# Altium schematic sheet Kasli-SOC_power-controller.SchDoc: Kasli-SOC
size A3; SheetNumber: 16; SheetTotal: 18
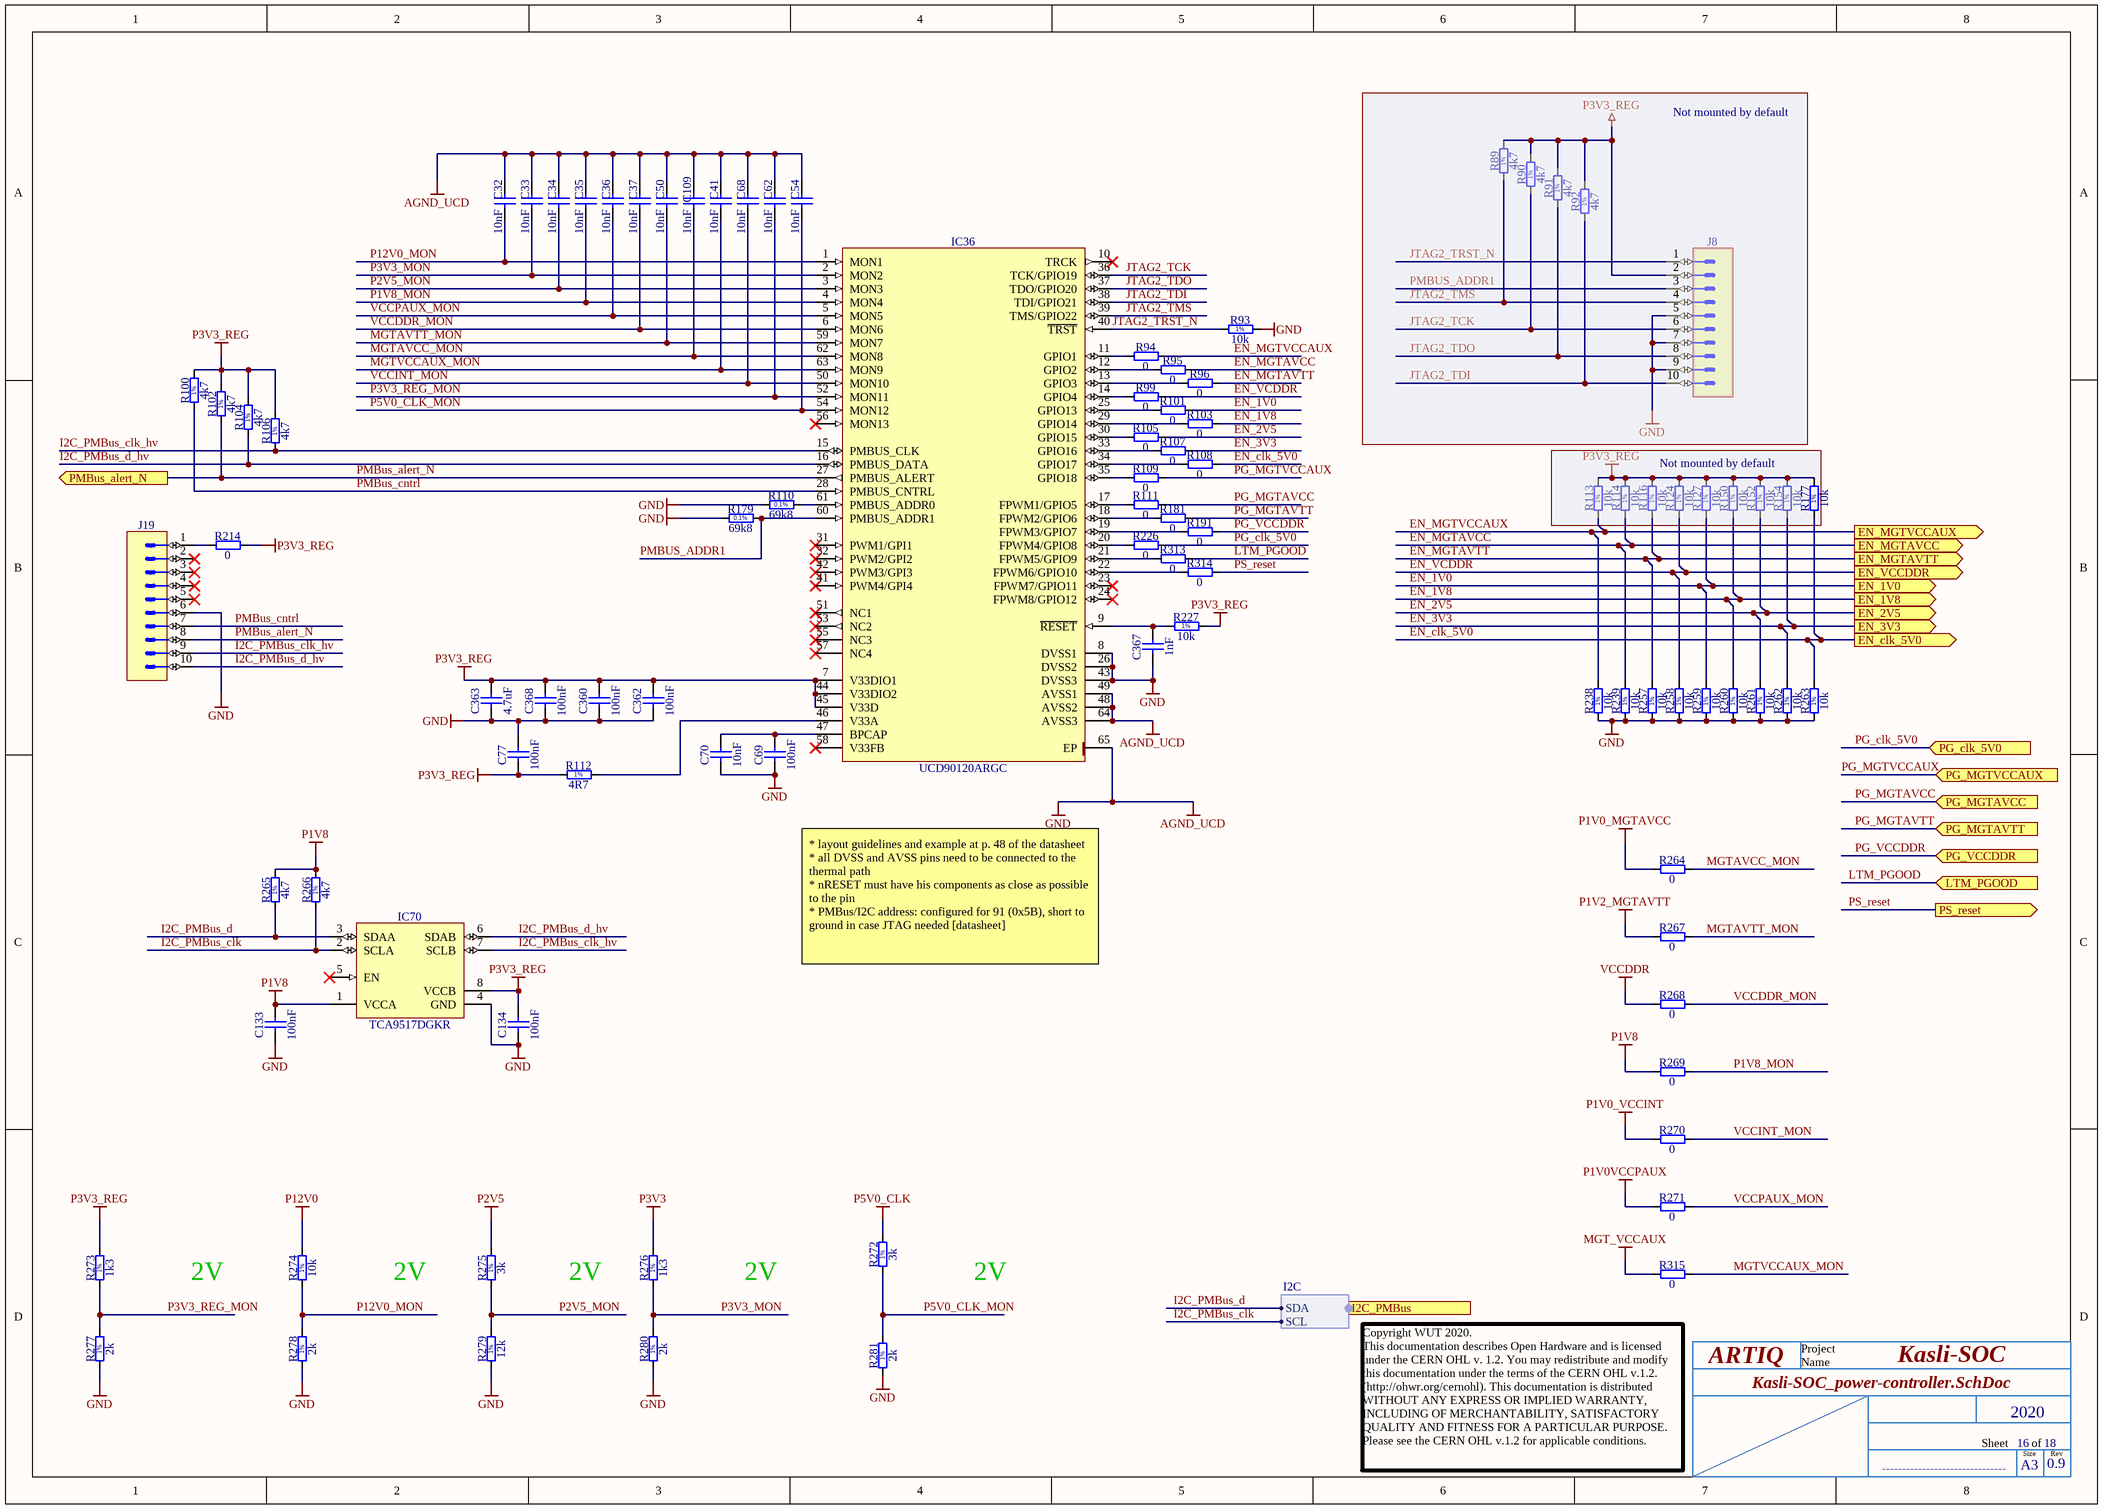
[diagram p0: Kasli-SOC_power-controller.SchDoc]

## Parts
C32  10nF  [CAPC1005X55N]
C33  10nF  [CAPC1005X55N]
C34  10nF  [CAPC1005X55N]
C35  10nF  [CAPC1005X55N]
C36  10nF  [CAPC1005X55N]
C37  10nF  [CAPC1005X55N]
C41  10nF  [CAPC1005X55N]
C50  10nF  [CAPC1005X55N]
C54  10nF  [CAPC1005X55N]
C62  10nF  [CAPC1005X55N]
C68  10nF  [CAPC1005X55N]
C69  100nF  [CAPC1005X55N]
C70  10nF  [CAPC1005X55N]
C77  100nF  [CAPC1005X55N]
C109  10nF  [CAPC1005X55N]
C133  100nF  [CAPC1005X55N]
C134  100nF  [CAPC1005X55N]
C360  100nF  [CAPC1005X55N]
C362  100nF  [CAPC1005X55N]
C363  4.7uF  [CAPC1005X55N]
C367  1nF  [CAPC1005X55N]
C368  100nF  [CAPC1005X55N]
IC36  UCD90120ARGC  [QFN50P900X900X100-65N-S425]
IC70  TCA9517DGKR  [SOP65P490X110-8N]
J8  AMPMODU  [TYCO_1241050-5]  (value not drawn)
J19  AMPMODU  [TYCO_1241050-5]  (value not drawn)
R89  4k7  [RESC1005X40N]
R90  4k7  [RESC1005X40N]
R91  4k7  [RESC1005X40N]
R92  4k7  [RESC1005X40N]
R93  10k  [RESC1005X40N]
R94  0  [RESC1005X40N]
R95  0  [RESC1005X40N]
R96  0  [RESC1005X40N]
R99  0  [RESC1005X40N]
R100  4k7  [RESC1005X40N]
R101  0  [RESC1005X40N]
R102  4k7  [RESC1005X40N]
R103  0  [RESC1005X40N]
R104  4k7  [RESC1005X40N]
R105  0  [RESC1005X40N]
R106  4k7  [RESC1005X40N]
R107  0  [RESC1005X40N]
R108  0  [RESC1005X40N]
R109  0  [RESC1005X40N]
R110  69k8  [RESC1608X55N]
R111  0  [RESC1005X40N]
R112  4R7  [RESC2012X60N]
R113  10k  [RESC1005X40N]
R114  10k  [RESC1005X40N]
R116  10k  [RESC1005X40N]
R124  10k  [RESC1005X40N]
R127  10k  [RESC1005X40N]
R150  10k  [RESC1005X40N]
R152  10k  [RESC1005X40N]
R154  10k  [RESC1005X40N]
R177  10k  [RESC1005X40N]
R179  69k8  [RESC1608X55N]
R181  0  [RESC1005X40N]
R191  0  [RESC1005X40N]
R214  0  [RESC1005X40N]
R226  0  [RESC1005X40N]
R227  10k  [RESC1005X40N]
R238  10k  [RESC1005X40N]
R239  10k  [RESC1005X40N]
R257  10k  [RESC1005X40N]
R258  10k  [RESC1005X40N]
R259  10k  [RESC1005X40N]
R260  10k  [RESC1005X40N]
R261  10k  [RESC1005X40N]
R262  10k  [RESC1005X40N]
R263  10k  [RESC1005X40N]
R264  0  [RESC1005X40N]
R265  4k7  [RESC2012X60N]
R266  4k7  [RESC2012X60N]
R267  0  [RESC1005X40N]
R268  0  [RESC1005X40N]
R269  0  [RESC1005X40N]
R270  0  [RESC1005X40N]
R271  0  [RESC1005X40N]
R272  3k  [RESC1005X40N]
R273  1k3  [RESC1005X40N]
R274  10k  [RESC1005X40N]
R275  3k  [RESC1005X40N]
R276  1k3  [RESC1005X40N]
R277  2k  [RESC1005X40N]
R278  2k  [RESC1005X40N]
R279  12k  [RESC1005X40N]
R280  2k  [RESC1005X40N]
R281  2k  [RESC1005X40N]
R313  0  [RESC1005X40N]
R314  0  [RESC1005X40N]
R315  0  [RESC1005X40N]

## Blocks framed on the sheet
Not mounted by default: J8 R89-R92
Not mounted by default: R113 R114 R116 R124 R127 R150 R152 R154 R177

## Ports
EN_1V0 (out), EN_1V8 (out), EN_2V5 (out), EN_3V3 (out), EN_clk_5V0 (out), EN_MGTAVCC (out), EN_MGTAVTT (out), EN_MGTVCCAUX (out), EN_VCCDDR (out), I2C_PMBus (harness I2C), LTM_PGOOD (in), PG_clk_5V0 (in), PG_MGTAVCC (in), PG_MGTAVTT (in), PG_MGTVCCAUX (in), PG_VCCDDR (in), PMBus_alert_N (out), PS_reset (out)

## Harnesses
I2C: SDA, SCL

## Nets
AGND_UCD: C32.2 C33.2 C34.2 C35.2 C36.2 C37.2 C41.2 C50.2 C54.2 C62.2 C68.2 C69.1 C70.1 C77.2 C109.2 C133.1 C134.1 C360.1 C362.1 C363.1 C367.1 C368.1 IC36.8(DVSS1) IC36.26(DVSS2) IC36.43(DVSS3) IC36.48(AVSS2) IC36.49(AVSS1) IC36.64(AVSS3) IC36.65(EP) IC70.4(GND) J8.5 J8.7 J8.9 J19.6 R93.2 R110.1 R179.1 R238.1 R239.1 R257.1 R258.1 R259.1 R260.1 R261.1 R262.1 R263.1 R277.1 R278.1 R279.1 R280.1 R281.1  [also labelled GND]
MGT_VCCAUX: R315.1
P1V0_MGTAVCC: R264.1
P1V0_VCCINT: R270.1
P1V0VCCPAUX: R271.1
P1V2_MGTAVTT: R267.1
P1V8: C133.2 IC70.1(VCCA) R265.2 R266.2 R269.1
P2V5: R275.2
P3V3: R276.2
P3V3_REG: C77.1 C134.2 C360.2 C362.2 C363.2 C368.2 IC36.7(V33DIO1) IC36.44(V33DIO2) IC36.45(V33D) IC70.8(VCCB) J8.2 R89.2 R90.2 R91.2 R92.2 R100.2 R102.2 R104.2 R106.2 R112.1 R113.2 R114.2 R116.2 R124.2 R127.2 R150.2 R152.2 R154.2 R177.2 R214.2 R227.2 R273.2
P5V0_CLK: R272.2
P12V0: R274.2
VCCDDR: R268.1
EN_1V0: R101.2 R127.1 R259.2 ; port EN_1V0
EN_1V8: R103.2 R150.1 R260.2 ; port EN_1V8
EN_2V5: R105.2 R152.1 R261.2 ; port EN_2V5
EN_3V3: R107.2 R154.1 R262.2 ; port EN_3V3
EN_clk_5V0: R108.2 R177.1 R263.2 ; port EN_clk_5V0
EN_MGTAVCC: R95.2 R114.1 R239.2 ; port EN_MGTAVCC
EN_MGTAVTT: R96.2 R116.1 R257.2 ; port EN_MGTAVTT
EN_MGTVCCAUX: R94.2 R113.1 R238.2 ; port EN_MGTVCCAUX
EN_VCDDR: R99.2 R124.1 R258.2 ; port EN_VCCDDR
I2C_PMBus_clk: IC70.2(SCLA) R266.1 ; port I2C_PMBus.SCL
I2C_PMBus_clk_hv: IC36.15(PMBUS_CLK) IC70.7(SCLB) J19.9 R106.1
I2C_PMBus_d: IC70.3(SDAA) R265.1 ; port I2C_PMBus.SDA
I2C_PMBus_d_hv: IC36.16(PMBUS_DATA) IC70.6(SDAB) J19.10 R104.1
JTAG2_TCK: IC36.36(TCK/GPIO19) J8.6 R90.1
JTAG2_TDI: IC36.38(TDI/GPIO21) J8.10 R92.1
JTAG2_TDO: IC36.37(TDO/GPIO20) J8.8 R91.1
JTAG2_TMS: IC36.39(TMS/GPIO22) J8.4 R89.1
JTAG2_TRST_N: IC36.40(~{TRST}) J8.1 R93.1
LTM_PGOOD: R313.2 ; port LTM_PGOOD
MGTAVCC_MON: C109.1 IC36.62(MON8) R264.2
MGTAVTT_MON: C50.1 IC36.59(MON7) R267.2
MGTVCCAUX_MON: C41.1 IC36.63(MON9) R315.2
P1V8_MON: C35.1 IC36.4(MON4) R269.2
P2V5_MON: C34.1 IC36.3(MON3) R275.1 R279.2
P3V3_MON: C33.1 IC36.2(MON2) R276.1 R280.2
P3V3_REG_MON: C62.1 IC36.52(MON11) R273.1 R277.2
P5V0_CLK_MON: C54.1 IC36.54(MON12) R272.1 R281.2
P12V0_MON: C32.1 IC36.1(MON1) R274.1 R278.2
PG_clk_5V0: R226.2 ; port PG_clk_5V0
PG_MGTAVCC: R111.2 ; port PG_MGTAVCC
PG_MGTAVTT: R181.2 ; port PG_MGTAVTT
PG_MGTVCCAUX: R109.2 ; port PG_MGTVCCAUX
PG_VCCDDR: R191.2 ; port PG_VCCDDR
PMBUS_ADDR1: IC36.60(PMBUS_ADDR1) J8.3 R179.2
PMBus_alert_N: IC36.27(PMBUS_ALERT) J19.8 R102.1 ; port PMBus_alert_N
PMBus_cntrl: IC36.28(PMBUS_CNTRL) J19.7 R100.1
PS_reset: R314.2 ; port PS_reset
VCCDDR_MON: C37.1 IC36.6(MON6) R268.2
VCCINT_MON: C68.1 IC36.50(MON10) R270.2
VCCPAUX_MON: C36.1 IC36.5(MON5) R271.2
NetC69_2: C69.2 C70.2 IC36.47(BPCAP)
NetC367_2: C367.2 IC36.9(~{RESET}) R227.1
NetIC36_11: IC36.11(GPIO1) R94.1
NetIC36_12: IC36.12(GPIO2) R95.1
NetIC36_13: IC36.13(GPIO3) R96.1
NetIC36_14: IC36.14(GPIO4) R99.1
NetIC36_17: IC36.17(FPWM1/GPIO5) R111.1
NetIC36_18: IC36.18(FPWM2/GPIO6) R181.1
NetIC36_19: IC36.19(FPWM3/GPIO7) R191.1
NetIC36_20: IC36.20(FPWM4/GPIO8) R226.1
NetIC36_21: IC36.21(FPWM5/GPIO9) R313.1
NetIC36_22: IC36.22(FPWM6/GPIO10) R314.1
NetIC36_25: IC36.25(GPIO13) R101.1
NetIC36_29: IC36.29(GPIO14) R103.1
NetIC36_30: IC36.30(GPIO15) R105.1
NetIC36_33: IC36.33(GPIO16) R107.1
NetIC36_34: IC36.34(GPIO17) R108.1
NetIC36_35: IC36.35(GPIO18) R109.1
NetIC36_46: IC36.46(V33A) R112.2
NetIC36_61: IC36.61(PMBUS_ADDR0) R110.2
NetJ19_1: J19.1 R214.1

Not connected (* = marked no-connect by the designer): IC36 10(TRCK)* 23(FPWM7/GPIO11)* 24(FPWM8/GPIO12)* 31(PWM1/GPI1)* 32(PWM2/GPI2)* 41(PWM4/GPI4)* 42(PWM3/GPI3)* 51(NC1)* 53(NC2)* 55(NC3)* 56(MON13)* 57(NC4)* 58(V33FB)*; IC70 5(EN)*; J19 2* 3* 4* 5*

## Notes on the sheet
- * layout guidelines and example at p. 48 of the datasheet
  * all DVSS and AVSS pins need to be connected to the thermal path
  * nRESET must have his components as close as possible to the pin
  * PMBus/I2C address: configured for 91 (0x5B), short to ground in case JTAG needed [datasheet]
- 2V
- (near R315) Copyright WUT 2020.
  This documentation describes Open Hardware and is licensed under the CERN OHL v. 1.2. You may redistribute and modify this documentation under the terms of the CERN OHL v.1.2. (http://ohwr.org/cernohl). This documentation is distributed WITHOUT ANY EXPRESS OR IMPLIED WARRANTY, INCLUDING OF MERCHANTABILITY, SATISFACTORY QUALITY AND FITNESS FOR A PARTICULAR PURPOSE.
  Please see the CERN OHL v.1.2 for applicable conditions.
- ARTIQ
- Project
- Name
- Sheet
- 2020
- Size
- A3
- of
- Rev
- -------------------------------
- 0.9
- (in symbol R0402_1K3_1%_0.0625W_100PPM) 1%
- (in symbol R0402_2K_1%_0.0625W_100PPM) 1%
- (in symbol R0402_3K_1%_0.0625W_100PPM) 1%
- (in symbol R0402_4K7_1%_0.0625W_100PPM) 1%
- (in symbol R0402_10K_1%_0.0625W_100PPM) 1%
- (in symbol R0402_12K_1%_0.0625W_100PPM) 1%
- (in symbol R0603_69K8_0.1%_0.063W_10PPM) 0.1%
- (in symbol R0805_4K7_1%_0.125W_100PPM) 1%
- (in symbol R0805_4R7_1%_0.125W_200PPM) 1%

## Library data of the parts
C32-C37 C41 C50 C54 C62 C68 C70 C109 = CC0402_10NF_25V_10%_X7R: Non-polarised capacitor; Part Description: SMD Multilayer Chip Ceramic Capacitor; Manufacturer: GENERIC; Manufacturer1 Part Number: C1005X7R1E103KT; Voltage: 25V; TC: X7R; Tolerance: ±10%; Part Number: CC0402_10NF_25V_10%_X7R; Component Kind: Standard; Component Type: Standard; Pin Count: 2; Value: 10nF; Status: Preferred; Manufacturer Part Number: CC0402_10NF_25V_10%_X7R; Case: 0402; Mounted: Yes; Socket: No; SMD: Yes; Sense: No; Manufacturer1 Example: TDK; Manufacturer1 ComponentHeight: 0.55mm; HelpURL: \\cern.ch\dfs\Applications\Altium\Datasheets\CC0402_X7R_TDK_C.pdf; Author: CERN DEM JLC; CreateDate: 10/25/2012; LatestRevisionDate: 10/25/2012
C69 C77 C133 C134 C360 C362 C368 = CC0402_100NF_16V_10%_X7R: Non-polarised capacitor; Part Description: SMD Multilayer Chip Ceramic Capacitor; Manufacturer: GENERIC; Manufacturer1 Part Number: GRM155R71C104KA88D; Voltage: 16V; TC: X7R; Tolerance: ±10%; Part Number: CC0402_100NF_16V_10%_X7R; Component Kind: Standard; Component Type: Standard; Pin Count: 2; Value: 100nF; Status: Not Recommended; Manufacturer Part Number: CC0402_100NF_16V_10%_X7R; Case: 0402; Mounted: Yes; Socket: No; SMD: Yes; Sense: No; Manufacturer1 Example: MURATA; Manufacturer1 ComponentHeight: 0.55mm; HelpURL: \\cern.ch\dfs\Applications\Altium\Datasheets\CC0402_X7R_MURATA_GRM.pdf; Author: CERN DEM JLC; CreateDate: 05/12/2013; LatestRevisionDate: 03/12/2007
C363 = CC0402_4.7UF_6.3V_20%_X5R: Non-polarised capacitor; Part Description: SMD Multilayer Chip Ceramic Capacitor; Manufacturer: GENERIC; Manufacturer1 Part Number: C1005X5R0J475M050BC; Voltage: 6.3V; TC: X5R; Tolerance: ±20%; Part Number: CC0402_4.7UF_6.3V_20%_X5R; Component Kind: Standard; Component Type: Standard; Pin Count: 2; Value: 4.7uF; Status: Preferred; Manufacturer Part Number: CC0402_4.7UF_6.3V_20%_X5R; Case: 0402; Mounted: Yes; Socket: No; SMD: Yes; Sense: No; Manufacturer1 Example: TDK; Manufacturer1 ComponentHeight: 0.65mm; HelpURL: \\cern.ch\dfs\Applications\Altium\Datasheets\CC0402_X5R_TDK_C.pdf; Author: CERN DEM JLC; CreateDate: 03/03/2015; LatestRevisionDate: 03/03/2015
C367 = CC0402_1NF_50V_10%_X7R: Non-polarised capacitor; Part Description: SMD Multilayer Chip Ceramic Capacitor; Manufacturer: GENERIC; Manufacturer1 Part Number: 223858715623; Voltage: 50V; TC: X7R; Tolerance: ±10%; Part Number: CC0402_1NF_50V_10%_X7R; Component Kind: Standard; Component Type: Standard; Pin Count: 2; Value: 1nF; Status: Not Recommended; Manufacturer Part Number: CC0402_1NF_50V_10%_X7R; Case: 0402; Mounted: Yes; Socket: No; SMD: Yes; Sense: No; Manufacturer1 Example: PHYCOMP; Manufacturer1 ComponentHeight: 0.55mm; HelpURL: \\cern.ch\dfs\Applications\Altium\Datasheets\CC0402_X7R_PHYCOMP.pdf; Author: CERN DEM JLC; CreateDate: 03/12/2007; LatestRevisionDate: 03/12/2007
IC36 = UCD90120ARGC: 12-Rail Power Supply Sequencer and Monitor; Part Description: 12-Rail Power Supply Sequencer and Monitor With ACPI Support; Manufacturer: TEXAS INSTRUMENTS; PressFit: No; Bonding: No; Part Number: UCD90120ARGC; Component Kind: Standard; Component Type: Standard; Device: UCD90120ARGC; PackageDescription: QFN, 0.50mm Pitch, Square; 64 Pin, 9.00mm L X 9.00mm W X 1.00mm H Body (4.25 X 4.25mm Thermal Tab), IPC Medium Density; Manufacturer Part Number: UCD90120ARGC; Pin Count: 65; Case: QFN64; Mounted: Yes; Socket: No; SMD: Yes; Sense: No; ComponentHeight: 1mm; Author: CERN DEM MR; HelpURL: \\cern.ch\dfs\Applications\Altium\Datasheets\UCD90120ARGC.pdf; CreateDate: 14/12/2015; LatestRevisionDate: 26/01/2016
IC70 = TCA9517DGKR: Level-Translating I2C Bus Repeater; Manufacturer: TEXAS INSTRUMENTS; PressFit: No; Bonding: No; Part Number: TCA9517DGKR; Component Kind: Standard; Component Type: Standard; Device: TCA9517DGKR; PackageDescription: SOP, 0.65mm pitch; 8 pin, 3.00mm W X 3.00mm L X 1.10mm H body, IPC Medium Density; Part Description: Level-Translating I2C Bus Repeater; Manufacturer Part Number: TCA9517DGKR; Pin Count: 8; Case: TSSOP8; Mounted: Yes; Socket: No; SMD: Yes; Sense: No; ComponentHeight: 1.1mm; Author: CERN DEM JLC; HelpURL: \\cern.ch\dfs\Applications\Altium\Datasheets\TCA9517DGKR.pdf; CreateDate: 07/07/2014; LatestRevisionDate: 07/07/2014
J8 J19 = TYCO_1241050-5: Connector 10 Male; Part Description: 10 Positions, Pitch 2.54mm, Dual-Row Surface Mount Vertical Header; Manufacturer: TYCO ELECTRONICS; PressFit: No; Part Number: TYCO_1241050-5; Component Kind: Standard; Component Type: Standard; Pin Count: 10; Family: AMPMODU; Mounted: Yes; Socket: No; SMD: Yes; Sense: No; Status: None; Manufacturer Part Number: TYCO_1241050-5; ComponentHeight: 10.21mm; HelpURL: \\cern.ch\dfs\Applications\Altium\Datasheets\TYCO_1241050-5.pdf; Author: CERN DEM JMW; CreateDate: 12/08/2015; LatestRevisionDate: 12/08/2015
R89-R92 R100 R102 R104 R106 = R0402_4K7_1%_0.0625W_100PPM: Resistor - 1%; Part Description: General Purpose Thick Film Chip Resistor; Manufacturer: GENERIC; Manufacturer1 Part Number: 232270674702L; TC: ±100ppm/°C; Part Number: R0402_4K7_1%_0.0625W_100PPM; Component Kind: Standard; Component Type: Standard; Pin Count: 2; Value: 4k7; Status: Not recommended; Power: 0.0625W; Tolerance: ±1%; Manufacturer Part Number: R0402_4K7_1%_0.0625W_100PPM; Case: 0402; Mounted: Yes; Sense: No; Socket: No; SMD: Yes; Manufacturer1 Example: YAGEO PHYCOMP; Manufacturer1 ComponentHeight: 0.4mm; HelpURL: \\cern.ch\dfs\Applications\Altium\Datasheets\R0402_Phycomp_RC0402.pdf; Author: CERN DEM JLC; CreateDate: 03.12.2007; LatestRevisionDate: 17.10.2012
R93 R113 R114 R116 R124 R127 R150 R152 R154 R177 R227 R238 R239 R257-R263 R274 = R0402_10K_1%_0.0625W_100PPM: Resistor - 1%; Part Description: General Purpose Thick Film Chip Resistor; Manufacturer: GENERIC; Manufacturer1 Part Number: 232270671003L; TC: ±100ppm/°C; Part Number: R0402_10K_1%_0.0625W_100PPM; Component Kind: Standard; Component Type: Standard; Pin Count: 2; Value: 10k; Status: Not recommended; Power: 0.0625W; Tolerance: ±1%; Manufacturer Part Number: R0402_10K_1%_0.0625W_100PPM; Case: 0402; Mounted: Yes; Sense: No; Socket: No; SMD: Yes; Manufacturer1 Example: YAGEO PHYCOMP; Manufacturer1 ComponentHeight: 0.4mm; HelpURL: \\cern.ch\dfs\Applications\Altium\Datasheets\R0402_Phycomp_RC0402.pdf; Author: CERN DEM JLC; CreateDate: 03.12.2007; LatestRevisionDate: 17.10.2012
R94-R96 R99 R101 R103 R105 R107-R109 R111 R181 R191 R214 R226 R264 R267-R271 R313 R314 = R0402_0R_JUMPER: Resistor; Part Description: 1A (0.05R Max DC Resistance) Zero Ohm Jumper; Manufacturer: GENERIC; Manufacturer1 Part Number: 232270591001L; Part Number: R0402_0R_JUMPER; Component Kind: Standard; Component Type: Standard; Pin Count: 2; Value: 0; Status: Not recommended; Manufacturer Part Number: R0402_0R_JUMPER; Case: 0402; Mounted: Yes; Sense: No; Socket: No; SMD: Yes; Manufacturer1 Example: YAGEO PHYCOMP; Manufacturer1 ComponentHeight: 0.4mm; HelpURL: \\cern.ch\dfs\Applications\Altium\Datasheets\R0402_Phycomp_RC0402.pdf; Author: CERN DEM JLC; CreateDate: 03.12.2007; LatestRevisionDate: 17.10.2012
R110 R179 = R0603_69K8_0.1%_0.063W_10PPM: Resistor - 0.1%; Part Description: Thin Film Chip Resistor; Manufacturer: GENERIC; Manufacturer1 Part Number: RN73C1J69K8BTDF; Power: 0.063W; TC: ±10ppm; PressFit: No; Part Number: R0603_69K8_0.1%_0.063W_10PPM; Component Kind: Standard; Component Type: Standard; Pin Count: 2; Value: 69k8; Status: Not Recommended; Tolerance: ±0.1%; Manufacturer Part Number: R0603_69K8_0.1%_0.063W_10PPM; Case: 0603; Mounted: Yes; Sense: No; Socket: No; SMD: Yes; Manufacturer1 Example: TYCO HOLSWORTHY; Manufacturer1 ComponentHeight: 0.5mm; HelpURL: \\cern.ch\dfs\Applications\Altium\Datasheets\R0603_Tyco_RN73.pdf; Author: CERN DEM JLC; CreateDate: 03/12/2007; LatestRevisionDate: 13/03/2008
R112 = R0805_4R7_1%_0.125W_200PPM: Resistor - 1%; Part Description: General Purpose Thick Film Chip Resistor; Manufacturer: GENERIC; Manufacturer1 Part Number: 232273464708L or RC0805FR-074R7L; Power: 0.125W; TC: ±200ppm/°C; PressFit: No; Part Number: R0805_4R7_1%_0.125W_200PPM; Component Kind: Standard; Component Type: Standard; Pin Count: 2; Value: 4R7; Status: Preferred; Tolerance: ±1%; Manufacturer Part Number: R0805_4R7_1%_0.125W_200PPM; Case: 0805; Mounted: Yes; Sense: No; Socket: No; SMD: Yes; Manufacturer1 Example: YAGEO PHYCOMP; Manufacturer1 ComponentHeight: 0.65mm; HelpURL: \\cern.ch\dfs\Applications\Altium\Datasheets\R0805_Phycomp_RC0805.pdf; Author: CERN DEM JLC; CreateDate: 03/12/2007; LatestRevisionDate: 17/10/2012
R265 R266 = R0805_4K7_1%_0.125W_100PPM: Resistor - 1%; Part Description: General Purpose Thick Film Chip Resistor; Manufacturer: GENERIC; Manufacturer1 Part Number: NRC10F4701TRF; Power: 0.125W; TC: ±100ppm/°C; PressFit: No; Part Number: R0805_4K7_1%_0.125W_100PPM; Component Kind: Standard; Component Type: Standard; Pin Count: 2; Value: 4k7; Status: Preferred; Tolerance: ±1%; Manufacturer Part Number: R0805_4K7_1%_0.125W_100PPM; Case: 0805; Mounted: Yes; Sense: No; Socket: No; SMD: Yes; Manufacturer1 Example: NIC COMPONENT; Manufacturer1 ComponentHeight: 0.6mm; HelpURL: \\cern.ch\dfs\Applications\Altium\Datasheets\R0805_NIC_NRC.pdf; Author: CERN DEM JLC; CreateDate: 03/12/2007; LatestRevisionDate: 13/03/2008
R272 R275 = R0402_3K_1%_0.0625W_100PPM: Resistor - 1%; Part Description: General Purpose Thick Film Chip Resistor; Manufacturer: GENERIC; Manufacturer1 Part Number: 232270673002L; TC: ±100ppm/°C; Part Number: R0402_3K_1%_0.0625W_100PPM; Component Kind: Standard; Component Type: Standard; Pin Count: 2; Value: 3k; Status: Not recommended; Power: 0.0625W; Tolerance: ±1%; Manufacturer Part Number: R0402_3K_1%_0.0625W_100PPM; Case: 0402; Mounted: Yes; Sense: No; Socket: No; SMD: Yes; Manufacturer1 Example: YAGEO PHYCOMP; Manufacturer1 ComponentHeight: 0.4mm; HelpURL: \\cern.ch\dfs\Applications\Altium\Datasheets\R0402_Phycomp_RC0402.pdf; Author: CERN DEM JLC; CreateDate: 03.12.2007; LatestRevisionDate: 17.10.2012
R273 R276 = R0402_1K3_1%_0.0625W_100PPM: Resistor - 1%; Part Description: General Purpose Thick Film Chip Resistor; Manufacturer: GENERIC; Manufacturer1 Part Number: 232270671302L; TC: ±100ppm/°C; Part Number: R0402_1K3_1%_0.0625W_100PPM; Component Kind: Standard; Component Type: Standard; Pin Count: 2; Value: 1k3; Status: Not recommended; Power: 0.0625W; Tolerance: ±1%; Manufacturer Part Number: R0402_1K3_1%_0.0625W_100PPM; Case: 0402; Mounted: Yes; Sense: No; Socket: No; SMD: Yes; Manufacturer1 Example: YAGEO PHYCOMP; Manufacturer1 ComponentHeight: 0.4mm; HelpURL: \\cern.ch\dfs\Applications\Altium\Datasheets\R0402_Phycomp_RC0402.pdf; Author: CERN DEM JLC; CreateDate: 03.12.2007; LatestRevisionDate: 17.10.2012
R277 R278 R280 R281 = R0402_2K_1%_0.0625W_100PPM: Resistor - 1%; Part Description: General Purpose Thick Film Chip Resistor; Manufacturer: GENERIC; Manufacturer1 Part Number: 232270672002L; TC: ±100ppm/°C; Part Number: R0402_2K_1%_0.0625W_100PPM; Component Kind: Standard; Component Type: Standard; Pin Count: 2; Value: 2k; Status: Not recommended; Power: 0.0625W; Tolerance: ±1%; Manufacturer Part Number: R0402_2K_1%_0.0625W_100PPM; Case: 0402; Mounted: Yes; Sense: No; Socket: No; SMD: Yes; Manufacturer1 Example: YAGEO PHYCOMP; Manufacturer1 ComponentHeight: 0.4mm; HelpURL: \\cern.ch\dfs\Applications\Altium\Datasheets\R0402_Phycomp_RC0402.pdf; Author: CERN DEM JLC; CreateDate: 03.12.2007; LatestRevisionDate: 17.10.2012
R279 = R0402_12K_1%_0.0625W_100PPM: Resistor - 1%; Part Description: General Purpose Thick Film Chip Resistor; Manufacturer: GENERIC; Manufacturer1 Part Number: 232270671203L; TC: ±100ppm/°C; Part Number: R0402_12K_1%_0.0625W_100PPM; Component Kind: Standard; Component Type: Standard; Pin Count: 2; Value: 12k; Status: Not recommended; Power: 0.0625W; Tolerance: ±1%; Manufacturer Part Number: R0402_12K_1%_0.0625W_100PPM; Case: 0402; Mounted: Yes; Sense: No; Socket: No; SMD: Yes; Manufacturer1 Example: YAGEO PHYCOMP; Manufacturer1 ComponentHeight: 0.4mm; HelpURL: \\cern.ch\dfs\Applications\Altium\Datasheets\R0402_Phycomp_RC0402.pdf; Author: CERN DEM JLC; CreateDate: 03.12.2007; LatestRevisionDate: 17.10.2012
R315 = R0402_0R_JUMPER: Resistor; Part Description: 1A (0.05R Max DC Resistance) Zero Ohm Jumper; Manufacturer: GENERIC; Manufacturer1 Part Number: 232270591001L; PressFit: No; Part Number: R0402_0R_JUMPER; Component Kind: Standard; Component Type: Standard; Pin Count: 2; Value: 0; Status: Not Recommended; Manufacturer Part Number: R0402_0R_JUMPER; Case: 0402; Mounted: Yes; Sense: No; Socket: No; SMD: Yes; Manufacturer1 Example: YAGEO PHYCOMP; Manufacturer1 ComponentHeight: 0.4mm; HelpURL: \\cern.ch\dfs\Applications\Altium\Datasheets\R0402_Phycomp_RC0402.pdf; Author: CERN DEM JLC; CreateDate: 03.12.2007; LatestRevisionDate: 17.10.2012